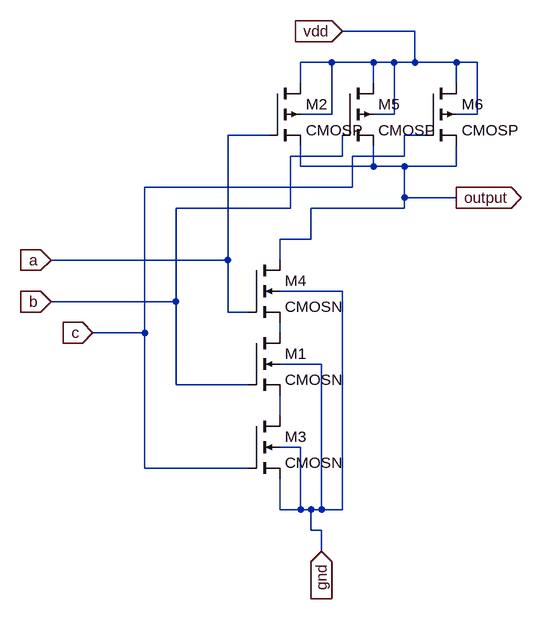
[diagram p0: schematic and3.asc]
and3.asc, the LTspice schematic file:
Version 4
SHEET 1 880 680
WIRE 368 -336 256 -336
WIRE 240 -288 192 -288
WIRE 304 -288 240 -288
WIRE 336 -288 304 -288
WIRE 368 -288 368 -336
WIRE 368 -288 336 -288
WIRE 432 -288 368 -288
WIRE 464 -288 432 -288
WIRE 192 -256 192 -288
WIRE 304 -256 304 -288
WIRE 432 -256 432 -288
WIRE 240 -208 240 -288
WIRE 240 -208 192 -208
WIRE 336 -208 336 -288
WIRE 336 -208 304 -208
WIRE 464 -208 464 -288
WIRE 464 -208 432 -208
WIRE 144 -176 80 -176
WIRE 384 -176 352 -176
WIRE 256 -144 256 -176
WIRE 256 -144 176 -144
WIRE 352 -144 352 -176
WIRE 352 -144 272 -144
WIRE 192 -128 192 -160
WIRE 304 -128 304 -160
WIRE 304 -128 192 -128
WIRE 352 -128 304 -128
WIRE 432 -128 432 -160
WIRE 432 -128 352 -128
WIRE 272 -96 272 -144
WIRE 272 -96 -48 -96
WIRE 352 -80 352 -128
WIRE 432 -80 352 -80
WIRE 176 -64 176 -144
WIRE 176 -64 0 -64
WIRE 352 -64 352 -80
WIRE 352 -64 208 -64
WIRE 208 -16 208 -64
WIRE 208 -16 160 -16
WIRE 80 16 80 -176
WIRE 80 16 -192 16
WIRE 160 16 160 -16
WIRE 256 64 160 64
WIRE 0 80 0 -64
WIRE 0 80 -192 80
WIRE 80 96 80 16
WIRE 112 96 80 96
WIRE -48 128 -48 -96
WIRE -48 128 -128 128
WIRE 160 128 160 112
WIRE 224 176 160 176
WIRE 0 208 0 80
WIRE 112 208 0 208
WIRE 160 256 160 224
WIRE 192 304 160 304
WIRE -48 336 -48 128
WIRE 112 336 -48 336
WIRE 160 400 160 352
WIRE 192 400 192 304
WIRE 192 400 160 400
WIRE 208 400 192 400
WIRE 224 400 224 176
WIRE 224 400 208 400
WIRE 256 400 256 64
WIRE 256 400 224 400
WIRE 208 432 208 400
WIRE 224 432 208 432
WIRE 224 464 224 432
FLAG 224 464 gnd
IOPIN 224 464 In
FLAG -192 16 a
IOPIN -192 16 In
FLAG -192 80 b
IOPIN -192 80 In
FLAG -128 128 c
IOPIN -128 128 In
FLAG 256 -336 vdd
IOPIN 256 -336 In
FLAG 432 -80 output
IOPIN 432 -80 Out
SYMBOL cmosn 112 128 R0
SYMATTR InstName M1
SYMATTR Value2 l=180n w=1u
SYMBOL cmosn 112 256 R0
SYMATTR InstName M3
SYMATTR Value2 l=180n w=1u
SYMBOL cmosn 112 16 R0
SYMATTR InstName M4
SYMATTR Value2 l=180n w=1u
SYMBOL cmosp 144 -256 R0
SYMATTR InstName M2
SYMATTR Value2 l=180n w=1u
SYMBOL cmosp 256 -256 R0
SYMATTR InstName M5
SYMATTR Value2 l=180n w=1u
SYMBOL cmosp 384 -256 R0
SYMATTR InstName M6
SYMATTR Value2 l=180n w=1u

The netlist it stands for:
* and3.asc
M1 N001 b N002 gnd CMOSN l=180n w=1u
M3 N002 c gnd gnd CMOSN l=180n w=1u
M4 output a N001 gnd CMOSN l=180n w=1u
M2 vdd a output vdd CMOSP l=180n w=1u
M5 vdd b output vdd CMOSP l=180n w=1u
M6 vdd c output vdd CMOSP l=180n w=1u
.model NMOS NMOS
.model PMOS PMOS
.lib standard.mos
.backanno
.end